# Altium schematic sheet MotorControl.SchDoc
size A4
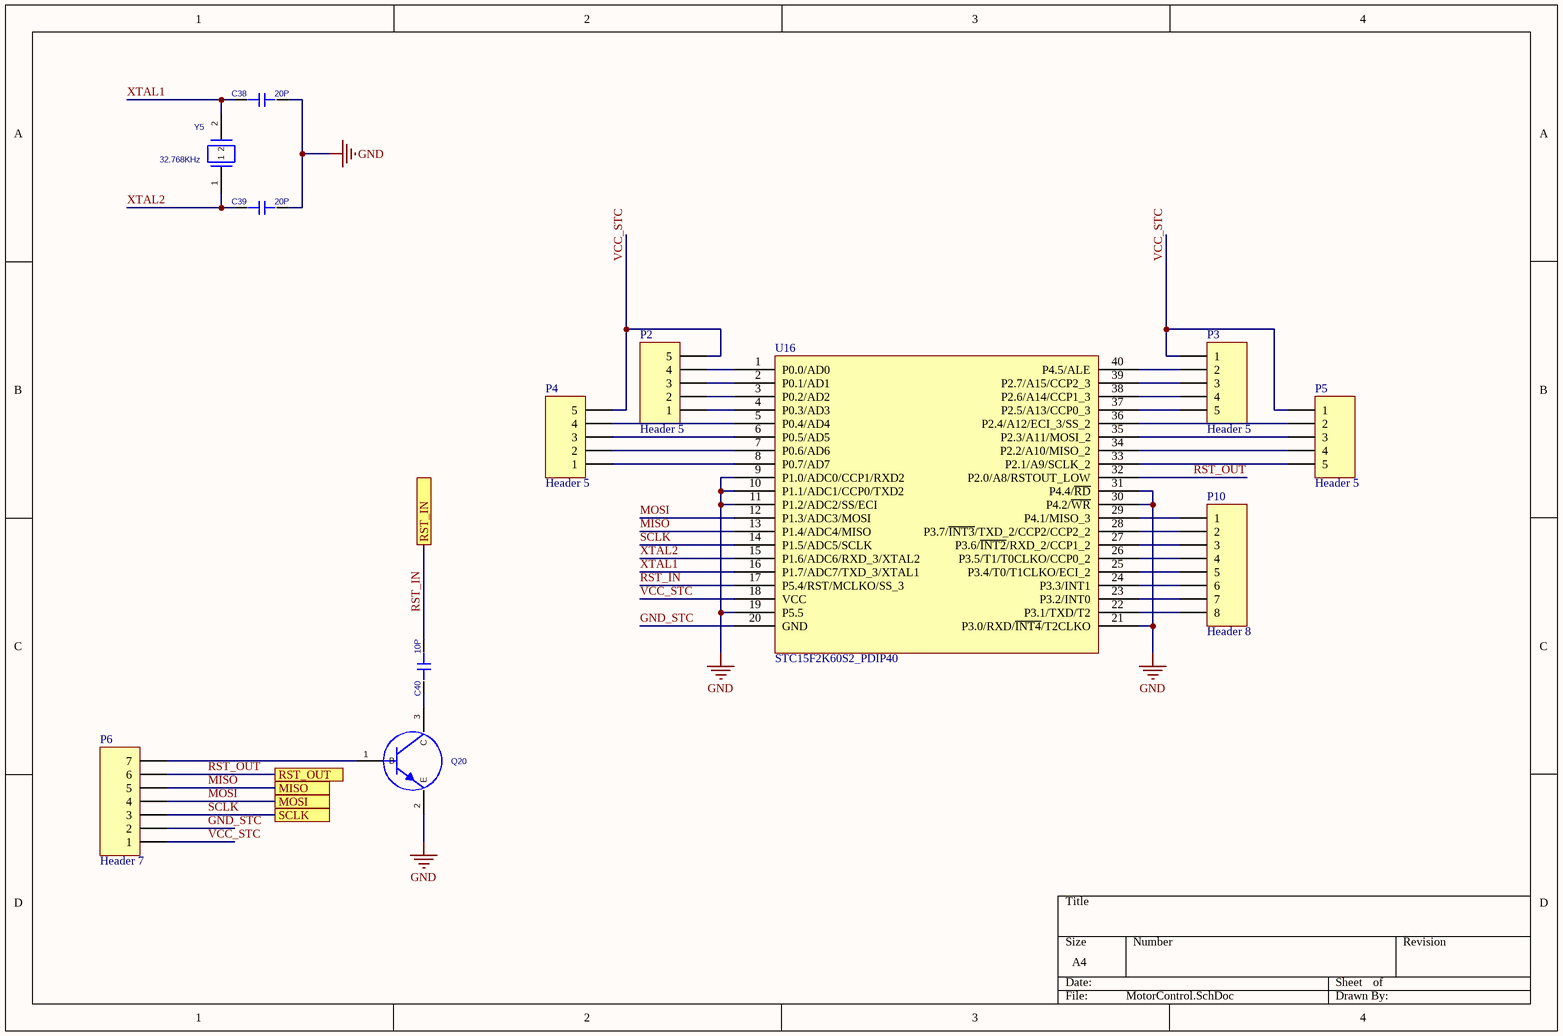
[diagram p0: MotorControl.SchDoc]

## Parts
C38  value 20P  [CAP_0603_FIRE]  (hidden comment: CAP_20P_0603_FIRE)
C39  value 20P  [CAP_0603_FIRE]  (hidden comment: CAP_20P_0603_FIRE)
C40  value 10P  [RES_0603_FIRE]  (hidden comment: CAP_10P_0603_FIRE)
P2  Header 5  [HDR1X5]
P3  Header 5  [HDR1X5]
P4  Header 5  [HDR1X5]
P5  Header 5  [HDR1X5]
P6  Header 7
P10  Header 8  [HDR1X8]
Q20  8050  [SOT-23]  (value not drawn)
U16  STC15F2K60S2_PDIP40  [DIP40]
Y5  value 32.768KHz  [3215]  (hidden comment: XTAL_32.768KHZ_3215)

## Ports
MISO, MOSI, RST_IN, RST_OUT, SCLK

## Nets
GND: C38.2 C39.2 Q20.2(E) U16.9(P1.0/ADC0/CCP1/RXD2) U16.10(P1.1/ADC1/CCP0/TXD2) U16.11(P1.2/ADC2/SS/ECI) U16.19(P5.5) U16.21(P3.0/RXD/~{INT4}/T2CLKO) U16.30(P4.2/~{WR}) U16.31(P4.4/~{RD})
GND_STC: P6.2 U16.20(GND)
MISO: P6.5 U16.13(P1.4/ADC4/MISO) ; port MISO
MOSI: P6.4 U16.12(P1.3/ADC3/MOSI) ; port MOSI
RST_IN: C40.2 U16.17(P5.4/RST/MCLKO/SS_3) ; port RST_IN
RST_OUT: P6.6 U16.32(P2.0/A8/RSTOUT_LOW) ; port RST_OUT
SCLK: P6.3 U16.14(P1.5/ADC5/SCLK) ; port SCLK
VCC_STC: P2.5 P3.1 P4.5 P5.1 P6.1 U16.18(VCC)
XTAL1: C38.1 U16.16(P1.7/ADC7/TXD_3/XTAL1) Y5.2
XTAL2: C39.1 U16.15(P1.6/ADC6/RXD_3/XTAL2) Y5.1
NetC40_1: C40.1 Q20.3(C)
NetP2_1: P2.1 U16.4(P0.3/AD3)
NetP2_2: P2.2 U16.3(P0.2/AD2)
NetP2_3: P2.3 U16.2(P0.1/AD1)
NetP2_4: P2.4 U16.1(P0.0/AD0)
NetP3_2: P3.2 U16.40(P4.5/ALE)
NetP3_3: P3.3 U16.39(P2.7/A15/CCP2_3)
NetP3_4: P3.4 U16.38(P2.6/A14/CCP1_3)
NetP3_5: P3.5 U16.37(P2.5/A13/CCP0_3)
NetP4_1: P4.1 U16.8(P0.7/AD7)
NetP4_2: P4.2 U16.7(P0.6/AD6)
NetP4_3: P4.3 U16.6(P0.5/AD5)
NetP4_4: P4.4 U16.5(P0.4/AD4)
NetP5_2: P5.2 U16.36(P2.4/A12/ECI_3/SS_2)
NetP5_3: P5.3 U16.35(P2.3/A11/MOSI_2)
NetP5_4: P5.4 U16.34(P2.2/A10/MISO_2)
NetP5_5: P5.5 U16.33(P2.1/A9/SCLK_2)
NetP6_7: P6.7 Q20.1(B)
NetP10_1: P10.1 U16.29(P4.1/MISO_3)
NetP10_2: P10.2 U16.28(P3.7/~{INT3}/TXD_2/CCP2/CCP2_2)
NetP10_3: P10.3 U16.27(P3.6/~{INT2}/RXD_2/CCP1_2)
NetP10_4: P10.4 U16.26(P3.5/T1/T0CLKO/CCP0_2)
NetP10_5: P10.5 U16.25(P3.4/T0/T1CLKO/ECI_2)
NetP10_6: P10.6 U16.24(P3.3/INT1)
NetP10_7: P10.7 U16.23(P3.2/INT0)
NetP10_8: P10.8 U16.22(P3.1/TXD/T2)

## Library data of the parts
C40 = CAP_10P_0603_FIRE: 0603; Manufacture 1: SUPERCAP; Tolerance: +-5%; PCB DECAL: RES_0603_FIRE
P2-P5 = Header 5: Header, 5-Pin; LatestRevisionDate: 17-Jul-2002; LatestRevisionNote: Re-released for DXP Platform.; Publisher: Altium Limited
P6 = Header 7: Header, 7-Pin; LatestRevisionDate: 17-Jul-2002; LatestRevisionNote: Re-released for DXP Platform.; Publisher: Altium Limited
P10 = Header 8: Header, 8-Pin; LatestRevisionDate: 17-Jul-2002; LatestRevisionNote: Re-released for DXP Platform.; Publisher: Altium Limited
Q20 = 8050: NPN; Manufacturer #2: 8050; PCB DECAL: SOT-23
Y5 = XTAL_32.768KHZ_3215: CRYSTAL; PCB DECAL: 3215
C38 C39 = CAP_20P_0603_FIRE: PCB DECAL: CAP_0603_FIRE